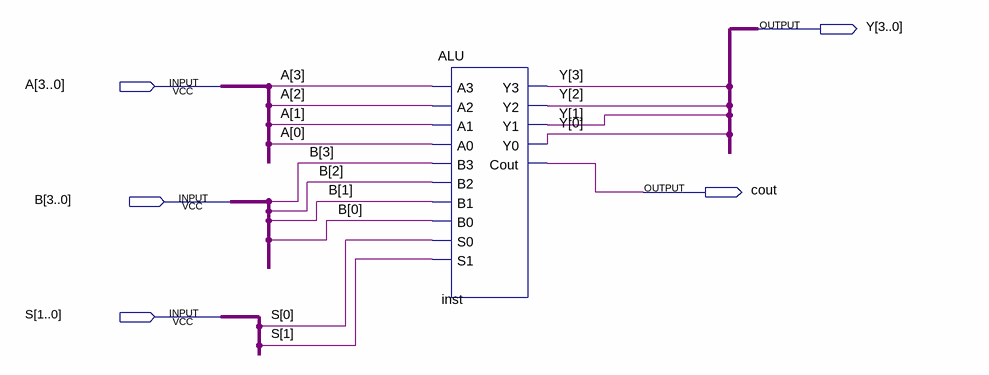
[diagram p0: schematic sheet]
// Quartus schematic A.bdf as structural Verilog: 1 symbols, 5 pins
module A (
  input  [3:0] A,
  input  [3:0] B,
  input  [1:0] S,
  output [3:0] Y,
  output cout
);

  ALU inst (
    .A3(A[3]), .A2(A[2]), .A1(A[1]), .A0(A[0]), .B3(B[3]), .B2(B[2]), .B1(B[1]), .B0(B[0]), .S0(S[0]),
    .S1(S[1]), .Y3(Y[3]), .Y2(Y[2]), .Y1(Y[1]), .Y0(Y[0]), .Cout(cout));
endmodule
